# Altium schematic sheet 88路激光器工程_3.SchDoc: Laser Driver Board V03
size A3; Revision: V02; SheetNumber: 3; SheetTotal: 3; DocStatus: Draft
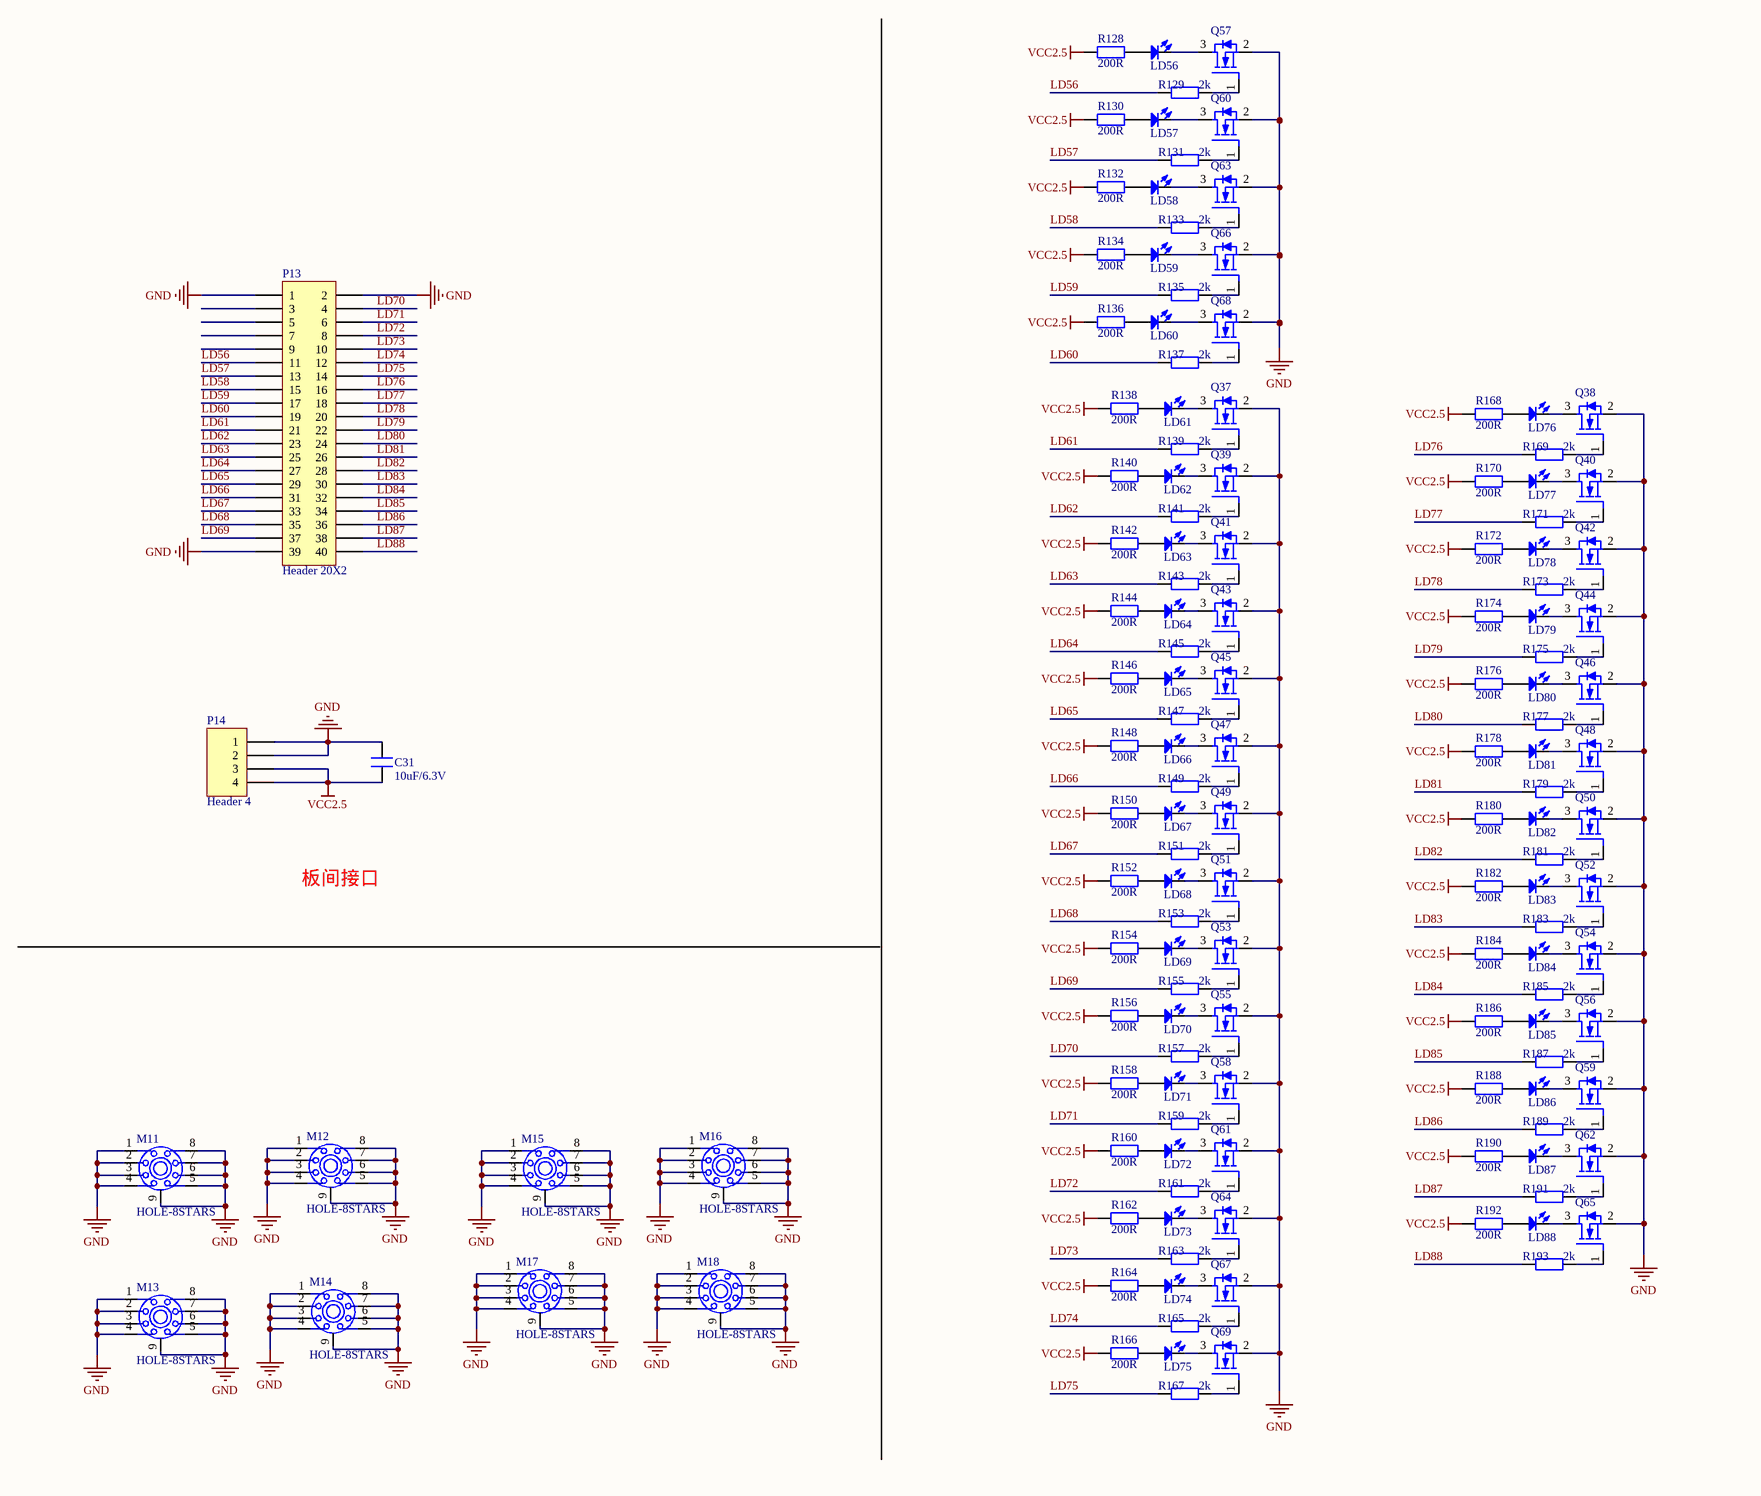
[diagram p0: 88路激光器工程_3.SchDoc, bottom]

## Parts
C31  10uF/6.3V  [C0805]
LD56  LD  [LD_3P]  (value not drawn)
LD57  LD  [LD_3P]  (value not drawn)
LD58  LD  [LD_3P]  (value not drawn)
LD59  LD  [LD_3P]  (value not drawn)
LD60  LD  [LD_3P]  (value not drawn)
LD61  LD  [LD_3P]  (value not drawn)
LD62  LD  [LD_3P]  (value not drawn)
LD63  LD  [LD_3P]  (value not drawn)
LD64  LD  [LD_3P]  (value not drawn)
LD65  LD  [LD_3P]  (value not drawn)
LD66  LD  [LD_3P]  (value not drawn)
LD67  LD  [LD_3P]  (value not drawn)
LD68  LD  [LD_3P]  (value not drawn)
LD69  LD  [LD_3P]  (value not drawn)
LD70  LD  [LD_3P]  (value not drawn)
LD71  LD  [LD_3P]  (value not drawn)
LD72  LD  [LD_3P]  (value not drawn)
LD73  LD  [LD_3P]  (value not drawn)
LD74  LD  [LD_3P]  (value not drawn)
LD75  LD  [LD_3P]  (value not drawn)
LD76  LD  [LD_3P]  (value not drawn)
LD77  LD  [LD_3P]  (value not drawn)
LD78  LD  [LD_3P]  (value not drawn)
LD79  LD  [LD_3P]  (value not drawn)
LD80  LD  [LD_3P]  (value not drawn)
LD81  LD  [LD_3P]  (value not drawn)
LD82  LD  [LD_3P]  (value not drawn)
LD83  LD  [LD_3P]  (value not drawn)
LD84  LD  [LD_3P]  (value not drawn)
LD85  LD  [LD_3P]  (value not drawn)
LD86  LD  [LD_3P]  (value not drawn)
LD87  LD  [LD_3P]  (value not drawn)
LD88  LD  [LD_3P]  (value not drawn)
M11  HOLE-8STARS  [HOLE_3MM]
M12  HOLE-8STARS  [HOLE_3MM]
M13  HOLE-8STARS  [HOLE_3MM]
M14  HOLE-8STARS  [HOLE_3MM]
M15  HOLE-8STARS  [HOLE_3MM]
M16  HOLE-8STARS  [HOLE_3MM]
M17  HOLE-8STARS  [HOLE_3MM]
M18  HOLE-8STARS  [HOLE_3MM]
P13  Header 20X2  [JATG_2.0mm_2x20P_SMD]
P14  Header 4  [XH2.54MM_4P_立式]
Q37  NMOS  [SOT23-3]  (value not drawn)
Q38  NMOS  [SOT23-3]  (value not drawn)
Q39  NMOS  [SOT23-3]  (value not drawn)
Q40  NMOS  [SOT23-3]  (value not drawn)
Q41  NMOS  [SOT23-3]  (value not drawn)
Q42  NMOS  [SOT23-3]  (value not drawn)
Q43  NMOS  [SOT23-3]  (value not drawn)
Q44  NMOS  [SOT23-3]  (value not drawn)
Q45  NMOS  [SOT23-3]  (value not drawn)
Q46  NMOS  [SOT23-3]  (value not drawn)
Q47  NMOS  [SOT23-3]  (value not drawn)
Q48  NMOS  [SOT23-3]  (value not drawn)
Q49  NMOS  [SOT23-3]  (value not drawn)
Q50  NMOS  [SOT23-3]  (value not drawn)
Q51  NMOS  [SOT23-3]  (value not drawn)
Q52  NMOS  [SOT23-3]  (value not drawn)
Q53  NMOS  [SOT23-3]  (value not drawn)
Q54  NMOS  [SOT23-3]  (value not drawn)
Q55  NMOS  [SOT23-3]  (value not drawn)
Q56  NMOS  [SOT23-3]  (value not drawn)
Q57  NMOS  [SOT23-3]  (value not drawn)
Q58  NMOS  [SOT23-3]  (value not drawn)
Q59  NMOS  [SOT23-3]  (value not drawn)
Q60  NMOS  [SOT23-3]  (value not drawn)
Q61  NMOS  [SOT23-3]  (value not drawn)
Q62  NMOS  [SOT23-3]  (value not drawn)
Q63  NMOS  [SOT23-3]  (value not drawn)
Q64  NMOS  [SOT23-3]  (value not drawn)
Q65  NMOS  [SOT23-3]  (value not drawn)
Q66  NMOS  [SOT23-3]  (value not drawn)
Q67  NMOS  [SOT23-3]  (value not drawn)
Q68  NMOS  [SOT23-3]  (value not drawn)
Q69  NMOS  [SOT23-3]  (value not drawn)
R128  200R  [R0805]
R129  2k  [R0805]
R130  200R  [R0805]
R131  2k  [R0805]
R132  200R  [R0805]
R133  2k  [R0805]
R134  200R  [R0805]
R135  2k  [R0805]
R136  200R  [R0805]
R137  2k  [R0805]
R138  200R  [R0805]
R139  2k  [R0805]
R140  200R  [R0805]
R141  2k  [R0805]
R142  200R  [R0805]
R143  2k  [R0805]
R144  200R  [R0805]
R145  2k  [R0805]
R146  200R  [R0805]
R147  2k  [R0805]
R148  200R  [R0805]
R149  2k  [R0805]
R150  200R  [R0805]
R151  2k  [R0805]
R152  200R  [R0805]
R153  2k  [R0805]
R154  200R  [R0805]
R155  2k  [R0805]
R156  200R  [R0805]
R157  2k  [R0805]
R158  200R  [R0805]
R159  2k  [R0805]
R160  200R  [R0805]
R161  2k  [R0805]
R162  200R  [R0805]
R163  2k  [R0805]
R164  200R  [R0805]
R165  2k  [R0805]
R166  200R  [R0805]
R167  2k  [R0805]
R168  200R  [R0805]
R169  2k  [R0805]
R170  200R  [R0805]
R171  2k  [R0805]
R172  200R  [R0805]
R173  2k  [R0805]
R174  200R  [R0805]
R175  2k  [R0805]
R176  200R  [R0805]
R177  2k  [R0805]
R178  200R  [R0805]
R179  2k  [R0805]
R180  200R  [R0805]
R181  2k  [R0805]
R182  200R  [R0805]
R183  2k  [R0805]
R184  200R  [R0805]
R185  2k  [R0805]
R186  200R  [R0805]
R187  2k  [R0805]
R188  200R  [R0805]
R189  2k  [R0805]
R190  200R  [R0805]
R191  2k  [R0805]
R192  200R  [R0805]
R193  2k  [R0805]

## Nets
GND: C31.2 M11.1 M11.2 M11.3 M11.4 M11.5 M11.6 M11.7 M11.8 M11.9 M12.1 M12.2 M12.3 M12.4 M12.5 M12.6 M12.7 M12.8 M12.9 M13.1 M13.2 M13.3 M13.4 M13.5 M13.6 M13.7 M13.8 M13.9 M14.1 M14.2 M14.3 M14.4 M14.5 M14.6 M14.7 M14.8 M14.9 M15.1 M15.2 M15.3 M15.4 M15.5 M15.6 M15.7 M15.8 M15.9 M16.1 M16.2 M16.3 M16.4 M16.5 M16.6 M16.7 M16.8 M16.9 M17.1 M17.2 M17.3 M17.4 M17.5 M17.6 M17.7 M17.8 M17.9 M18.1 M18.2 M18.3 M18.4 M18.5 M18.6 M18.7 M18.8 M18.9 P13.1 P13.2 P13.39 P14.1 P14.2 Q37.2(SOURCE) Q38.2(SOURCE) Q39.2(SOURCE) Q40.2(SOURCE) Q41.2(SOURCE) Q42.2(SOURCE) Q43.2(SOURCE) Q44.2(SOURCE) Q45.2(SOURCE) Q46.2(SOURCE) Q47.2(SOURCE) Q48.2(SOURCE) Q49.2(SOURCE) Q50.2(SOURCE) Q51.2(SOURCE) Q52.2(SOURCE) Q53.2(SOURCE) Q54.2(SOURCE) Q55.2(SOURCE) Q56.2(SOURCE) Q57.2(SOURCE) Q58.2(SOURCE) Q59.2(SOURCE) Q60.2(SOURCE) Q61.2(SOURCE) Q62.2(SOURCE) Q63.2(SOURCE) Q64.2(SOURCE) Q65.2(SOURCE) Q66.2(SOURCE) Q67.2(SOURCE) Q68.2(SOURCE) Q69.2(SOURCE)
VCC2.5: C31.1 P14.3 P14.4 R128.2 R130.2 R132.2 R134.2 R136.2 R138.2 R140.2 R142.2 R144.2 R146.2 R148.2 R150.2 R152.2 R154.2 R156.2 R158.2 R160.2 R162.2 R164.2 R166.2 R168.2 R170.2 R172.2 R174.2 R176.2 R178.2 R180.2 R182.2 R184.2 R186.2 R188.2 R190.2 R192.2
LD56: P13.11 R129.2
LD57: P13.13 R131.2
LD58: P13.15 R133.2
LD59: P13.17 R135.2
LD60: P13.19 R137.2
LD61: P13.21 R139.2
LD62: P13.23 R141.2
LD63: P13.25 R143.2
LD64: P13.27 R145.2
LD65: P13.29 R147.2
LD66: P13.31 R149.2
LD67: P13.33 R151.2
LD68: P13.35 R153.2
LD69: P13.37 R155.2
LD70: P13.4 R157.2
LD71: P13.6 R159.2
LD72: P13.8 R161.2
LD73: P13.10 R163.2
LD74: P13.12 R165.2
LD75: P13.14 R167.2
LD76: P13.16 R169.2
LD77: P13.18 R171.2
LD78: P13.20 R173.2
LD79: P13.22 R175.2
LD80: P13.24 R177.2
LD81: P13.26 R179.2
LD82: P13.28 R181.2
LD83: P13.30 R183.2
LD84: P13.32 R185.2
LD85: P13.34 R187.2
LD86: P13.36 R189.2
LD87: P13.38 R191.2
LD88: P13.40 R193.2
NetLD56_1: LD56.1(A) R128.1
NetLD56_2: LD56.2(K) Q57.3(DRAIN)
NetLD57_1: LD57.1(A) R130.1
NetLD57_2: LD57.2(K) Q60.3(DRAIN)
NetLD58_1: LD58.1(A) R132.1
NetLD58_2: LD58.2(K) Q63.3(DRAIN)
NetLD59_1: LD59.1(A) R134.1
NetLD59_2: LD59.2(K) Q66.3(DRAIN)
NetLD60_1: LD60.1(A) R136.1
NetLD60_2: LD60.2(K) Q68.3(DRAIN)
NetLD61_1: LD61.1(A) R138.1
NetLD61_2: LD61.2(K) Q37.3(DRAIN)
NetLD62_1: LD62.1(A) R140.1
NetLD62_2: LD62.2(K) Q39.3(DRAIN)
NetLD63_1: LD63.1(A) R142.1
NetLD63_2: LD63.2(K) Q41.3(DRAIN)
NetLD64_1: LD64.1(A) R144.1
NetLD64_2: LD64.2(K) Q43.3(DRAIN)
NetLD65_1: LD65.1(A) R146.1
NetLD65_2: LD65.2(K) Q45.3(DRAIN)
NetLD66_1: LD66.1(A) R148.1
NetLD66_2: LD66.2(K) Q47.3(DRAIN)
NetLD67_1: LD67.1(A) R150.1
NetLD67_2: LD67.2(K) Q49.3(DRAIN)
NetLD68_1: LD68.1(A) R152.1
NetLD68_2: LD68.2(K) Q51.3(DRAIN)
NetLD69_1: LD69.1(A) R154.1
NetLD69_2: LD69.2(K) Q53.3(DRAIN)
NetLD70_1: LD70.1(A) R156.1
NetLD70_2: LD70.2(K) Q55.3(DRAIN)
NetLD71_1: LD71.1(A) R158.1
NetLD71_2: LD71.2(K) Q58.3(DRAIN)
NetLD72_1: LD72.1(A) R160.1
NetLD72_2: LD72.2(K) Q61.3(DRAIN)
NetLD73_1: LD73.1(A) R162.1
NetLD73_2: LD73.2(K) Q64.3(DRAIN)
NetLD74_1: LD74.1(A) R164.1
NetLD74_2: LD74.2(K) Q67.3(DRAIN)
NetLD75_1: LD75.1(A) R166.1
NetLD75_2: LD75.2(K) Q69.3(DRAIN)
NetLD76_1: LD76.1(A) R168.1
NetLD76_2: LD76.2(K) Q38.3(DRAIN)
NetLD77_1: LD77.1(A) R170.1
NetLD77_2: LD77.2(K) Q40.3(DRAIN)
NetLD78_1: LD78.1(A) R172.1
NetLD78_2: LD78.2(K) Q42.3(DRAIN)
NetLD79_1: LD79.1(A) R174.1
NetLD79_2: LD79.2(K) Q44.3(DRAIN)
NetLD80_1: LD80.1(A) R176.1
NetLD80_2: LD80.2(K) Q46.3(DRAIN)
NetLD81_1: LD81.1(A) R178.1
NetLD81_2: LD81.2(K) Q48.3(DRAIN)
NetLD82_1: LD82.1(A) R180.1
NetLD82_2: LD82.2(K) Q50.3(DRAIN)
NetLD83_1: LD83.1(A) R182.1
NetLD83_2: LD83.2(K) Q52.3(DRAIN)
NetLD84_1: LD84.1(A) R184.1
NetLD84_2: LD84.2(K) Q54.3(DRAIN)
NetLD85_1: LD85.1(A) R186.1
NetLD85_2: LD85.2(K) Q56.3(DRAIN)
NetLD86_1: LD86.1(A) R188.1
NetLD86_2: LD86.2(K) Q59.3(DRAIN)
NetLD87_1: LD87.1(A) R190.1
NetLD87_2: LD87.2(K) Q62.3(DRAIN)
NetLD88_1: LD88.1(A) R192.1
NetLD88_2: LD88.2(K) Q65.3(DRAIN)
NetQ37_1: Q37.1(GATE) R139.1
NetQ38_1: Q38.1(GATE) R169.1
NetQ39_1: Q39.1(GATE) R141.1
NetQ40_1: Q40.1(GATE) R171.1
NetQ41_1: Q41.1(GATE) R143.1
NetQ42_1: Q42.1(GATE) R173.1
NetQ43_1: Q43.1(GATE) R145.1
NetQ44_1: Q44.1(GATE) R175.1
NetQ45_1: Q45.1(GATE) R147.1
NetQ46_1: Q46.1(GATE) R177.1
NetQ47_1: Q47.1(GATE) R149.1
NetQ48_1: Q48.1(GATE) R179.1
NetQ49_1: Q49.1(GATE) R151.1
NetQ50_1: Q50.1(GATE) R181.1
NetQ51_1: Q51.1(GATE) R153.1
NetQ52_1: Q52.1(GATE) R183.1
NetQ53_1: Q53.1(GATE) R155.1
NetQ54_1: Q54.1(GATE) R185.1
NetQ55_1: Q55.1(GATE) R157.1
NetQ56_1: Q56.1(GATE) R187.1
NetQ57_1: Q57.1(GATE) R129.1
NetQ58_1: Q58.1(GATE) R159.1
NetQ59_1: Q59.1(GATE) R189.1
NetQ60_1: Q60.1(GATE) R131.1
NetQ61_1: Q61.1(GATE) R161.1
NetQ62_1: Q62.1(GATE) R191.1
NetQ63_1: Q63.1(GATE) R133.1
NetQ64_1: Q64.1(GATE) R163.1
NetQ65_1: Q65.1(GATE) R193.1
NetQ66_1: Q66.1(GATE) R135.1
NetQ67_1: Q67.1(GATE) R165.1
NetQ68_1: Q68.1(GATE) R137.1
NetQ69_1: Q69.1(GATE) R167.1

Not connected (* = marked no-connect by the designer): P13 3 5 7 9

## Notes on the sheet
- 板间接口
- Title
- Date
- Status
- Sheet
- Rev
- of

## Library data of the parts
C31 = C
P13 = Header 20X2: Header, 20-Pin, Dual row; LatestRevisionDate: 17-Jul-2002; LatestRevisionNote: Re-released for DXP Platform.; Publisher: Altium Limited
P14 = Header 4: Header, 4-Pin; LatestRevisionDate: 17-Jul-2002; LatestRevisionNote: Re-released for DXP Platform.; Publisher: Altium Limited
R128-R193 = Res2: Resistor; Published: 8-Jun-2000; LatestRevisionDate: 17-Jul-2002; LatestRevisionNote: Re-released for DXP Platform.; PackageReference: AXIAL-0.4; Publisher: Altium Limited; PackageDescription: Axial Device, Thru-Hole; 2 Leads; 0.4 in Pin Spacing
  R128 R130 R132 R134 R136 R138 R140 R142 R144 R146 R148 R150 R152 R154 R156 R158 R160 R162 R164 R166 R168 R170 R172 R174 R176 R178 R180 R182 R184 R186 R188 R190 R192: Value: 200R
  R129 R131 R133 R135 R137 R139 R141 R143 R145 R147 R149 R151 R153 R155 R157 R159 R161 R163 R165 R167 R169 R171 R173 R175 R177 R179 R181 R183 R185 R187 R189 R191 R193: Value: 2k